# Altium schematic sheet main.SchDoc
size A; SheetNumber: 1; SheetTotal: 2
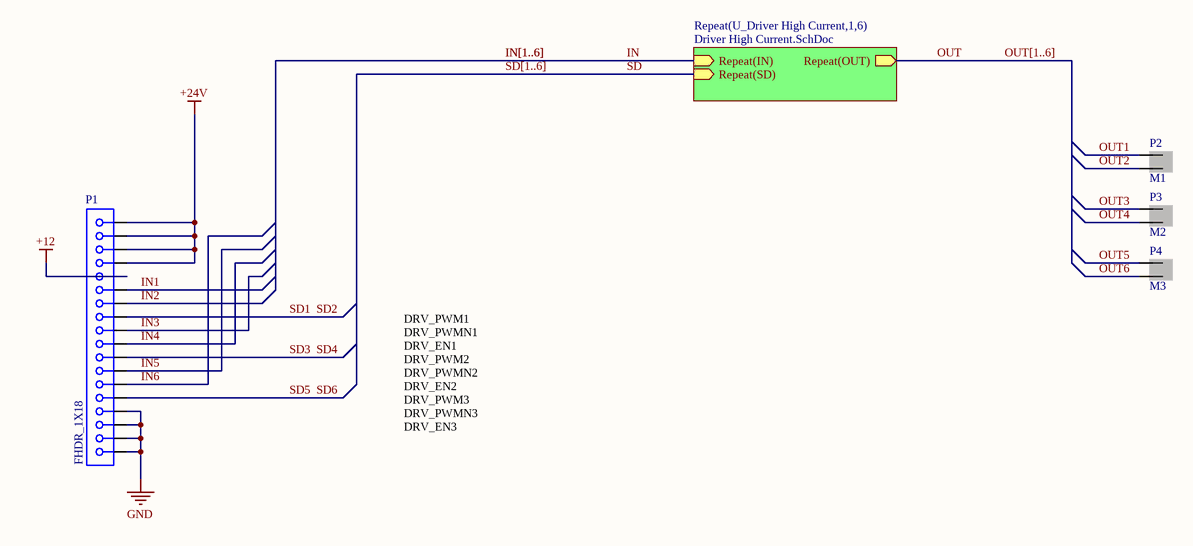
[diagram p0: main.SchDoc]

## Parts
P1  FHDR_1X18  [FHDR1X18-254P]
P2  M1  [ATX 2PIN]
P3  M2  [ATX 2PIN]
P4  M3  [ATX 2PIN]

## Sub-sheets
Repeat(U_Driver High Current,1,6) = Driver High Current.SchDoc: Repeat(IN) (in), Repeat(SD) (in), Repeat(OUT) (out)

## Nets
+12: P1.5
+24V: P1.1 P1.2 P1.3 P1.4
GND: P1.15 P1.16 P1.17 P1.18
IN: sheet Repeat(U_Driver High Current,1,6)/Repeat(IN)
IN1: P1.6
IN2: P1.7
IN3: P1.9
IN4: P1.10
IN5: P1.12
IN6: P1.13
OUT: sheet Repeat(U_Driver High Current,1,6)/Repeat(OUT)  [also labelled OUT[1..6]]
OUT1: P2.1
OUT2: P2.2
OUT3: P3.1
OUT4: P3.2
OUT5: P4.1
OUT6: P4.2
SD: sheet Repeat(U_Driver High Current,1,6)/Repeat(SD)
SD1: P1.8  [also labelled SD2]
SD3: P1.11  [also labelled SD4]
SD5: P1.14  [also labelled SD6]

## Buses and harness runs
bus IN[1..6]
bus SD[1..6]

## Notes on the sheet
- DRV_PWM1
  DRV_PWMN1
  DRV_EN1
  DRV_PWM2
  DRV_PWMN2
  DRV_EN2
  DRV_PWM3
  DRV_PWMN3
  DRV_EN3

## Library data of the parts
P1 = FHDR_1X18: Female Header 1X18
P2-P4 = ATX 2PIN